# EAGLE design autoroute (EAGLE 9.6.2)
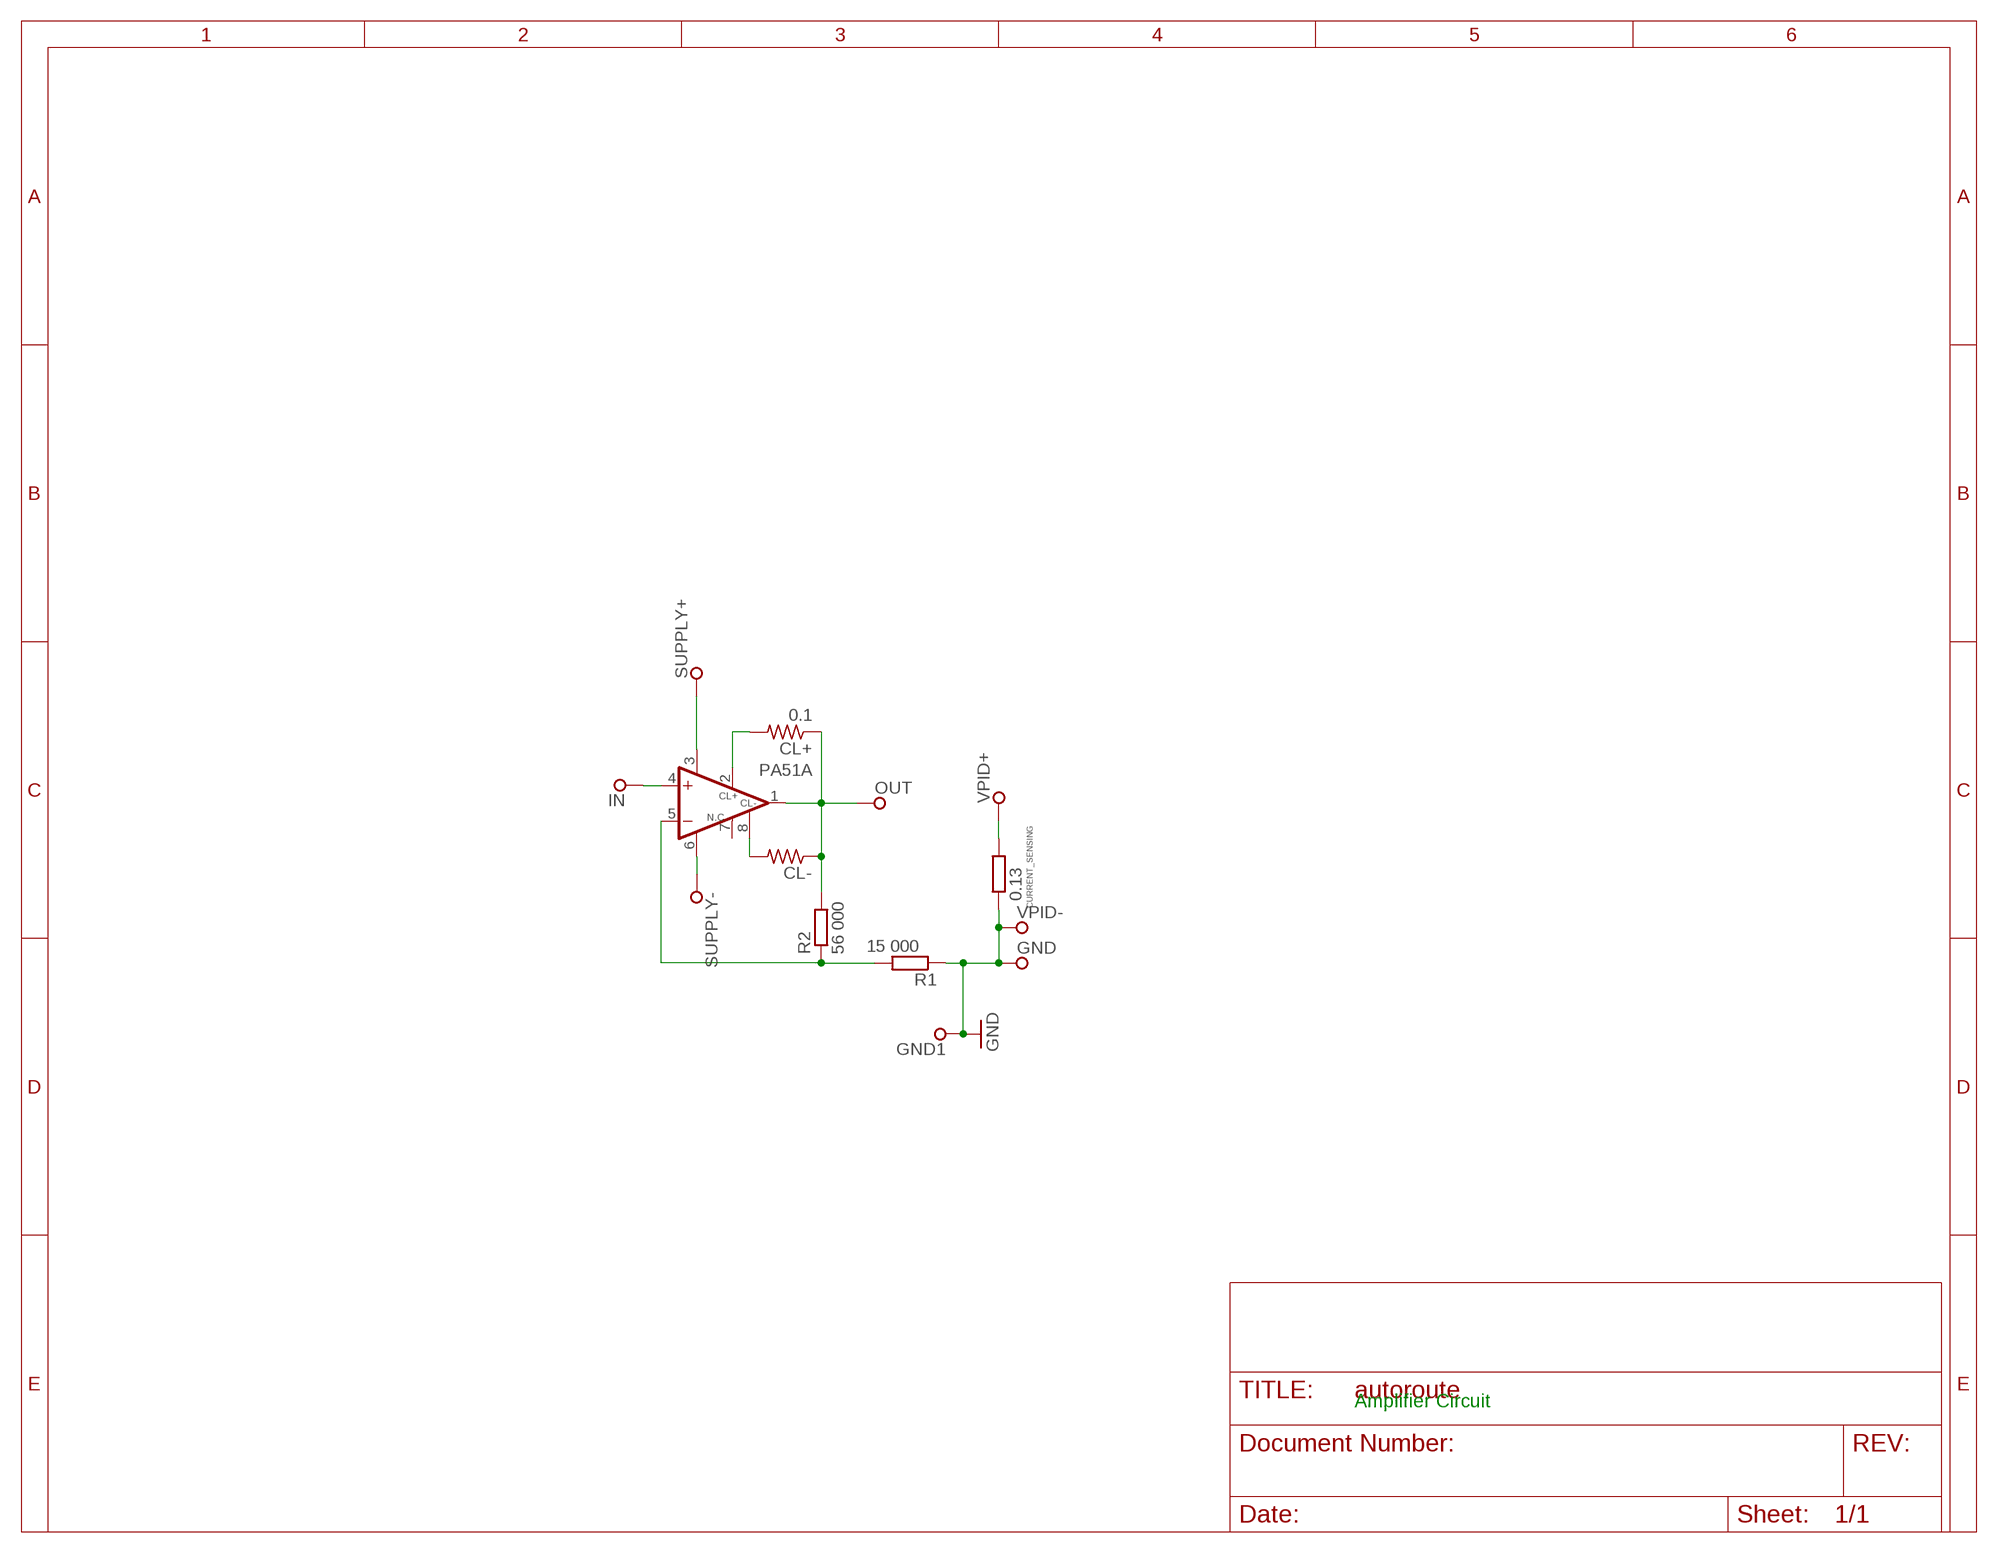
[diagram p0: schematic, sheet 1]

## Parts
CL+  0.1  R-US_VTA56  [VTA56]
CL-  R-US_VTA56  [VTA56]
CURRENT_SENSING  0.13  R-EU_V234/12  [V234/12]
GND  SPECIAL_DRILL_0.2500  [PAD_0.2500]
GND1  SPECIAL_DRILL_0.2500  [PAD_0.2500]
IN  SPECIAL_DRILL_0.2500  [PAD_0.2500]
OUT  SPECIAL_DRILL_0.2500  [PAD_0.2500]
R1  15 000  R-EU_V234/12  [V234/12]
R2  56 000  R-EU_V234/12  [V234/12]
SUPPLY+  SPECIAL_DRILL_0.2500  [PAD_0.2500]
SUPPLY-  SPECIAL_DRILL_0.2500  [PAD_0.2500]
U$1  PA51A  [0804MC]
VPID+  SPECIAL_DRILL_0.2500  [PAD_0.2500]
VPID-  SPECIAL_DRILL_0.2500  [PAD_0.2500]

## Nets
GND: CURRENT_SENSING.1 GND1.1 GND.1 R1.1 VPID-.1
N$1: CL+.1 CL-.1 OUT.1 R2.2 U$1.1(OUT)
N$2: R1.2 R2.1 U$1.5(-IN)
N$3: CL-.2 U$1.8(CL-)
N$4: SUPPLY-.1 U$1.6(V-)
N$5: SUPPLY+.1 U$1.3(V+)
N$6: CL+.2 U$1.2(CL+)
N$7: CURRENT_SENSING.2 VPID+.1
N$8: IN.1 U$1.4(+IN)
Unconnected: U$1.7(NC)

## Notes on the sheet
- Amplifier Circuit

## Library data of the parts
CL+ CL- = rcl:R-US_: RESISTOR, American symbol; SPICEPREFIX: R
CURRENT_SENSING R1 R2 = rcl:R-EU_: RESISTOR, European symbol; SPICEPREFIX: R
GND GND1 IN OUT SUPPLY+ SUPPLY- VPID+ VPID- = special-drill:SPECIAL_DRILL_: Special drills
U$1 = amp:PA51A

## Board
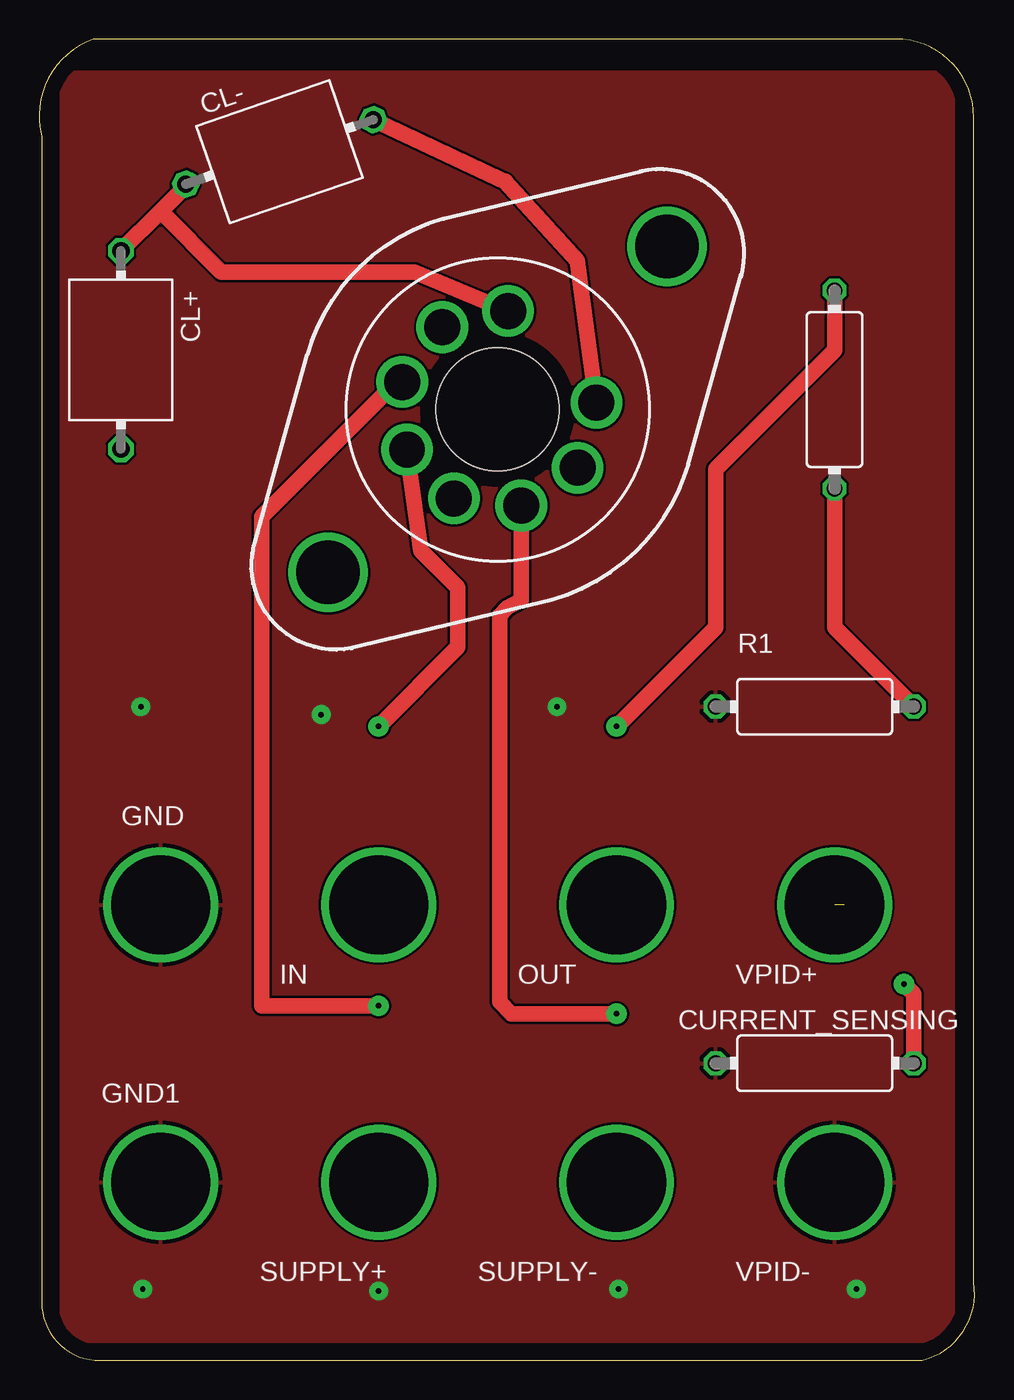
[diagram p1: board, top side]
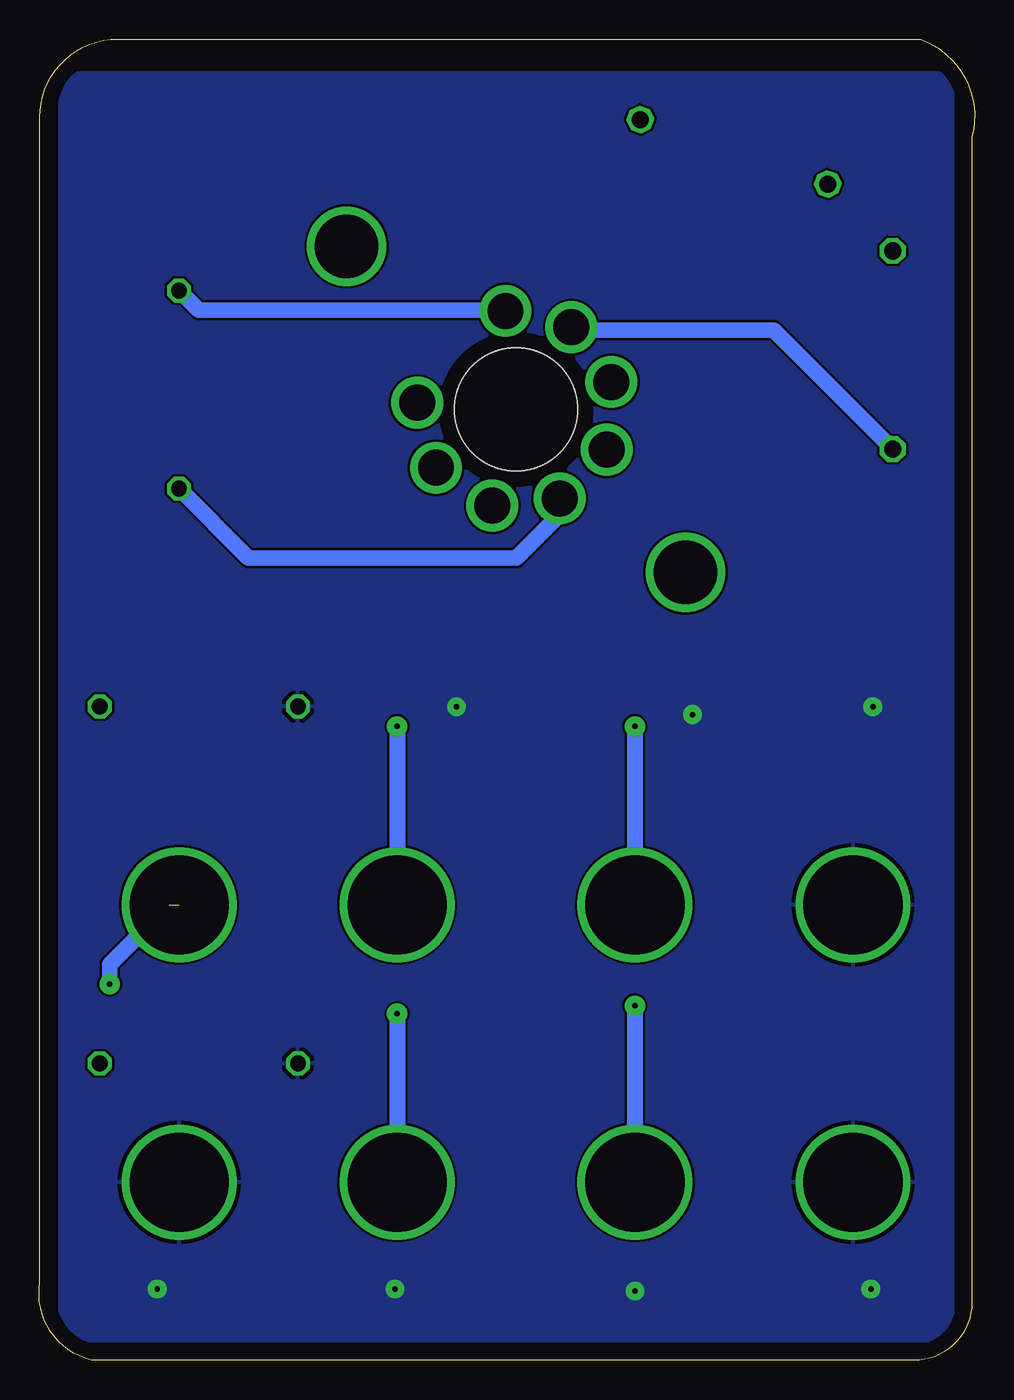
[diagram p2: board, bottom side, seen from below]

Size 59.94 x 84.7 mm. Coordinates in mm from the lower left corner, seen from the top.
Outline: 0.17,78.43 0.17,3.73 arc90 3.9,0 56.16,0 56.6,0.02 arc85 59.89,5 59.89,79.7 59.87,80.14 arc85 54.89,84.7 3.9,84.7 3.46,84.68 arc85 0.17,78.43
Copper layers (1*16): Top 0.035mm / dielectric 1.5mm / Bottom 0.035mm
Design rules "default *": minimum track width 6mil, minimum drill 0.35mm, track to track 6mil, track to pad 6mil, pad to pad 6mil, via to via 6mil, smd to smd 6mil, copper to edge 40mil, drill to drill 6mil, minimum pad ring 10mil, minimum via ring 8mil, stop-mask expansion 4mil, vias tented up to drill 0mil, thermal gap 10mil
Holes 7.87 mm at 29.38,60.96

### Footprints (pad centres in the part's own frame; a part is rotated, then mirrored left to right if it is on the bottom)
VTA56 = drill 1.1 octagon: 1 -6.35,0; 2 6.35,0
V234/12 = drill 1.016 octagon: 1 -6.35,0; 2 6.35,0
PAD_0.2500 = drill 6.35 pad 6.35: 1 0,0
0804MC = drill 2.3 pad 2.54: 1 -4.86,-4.08; 2 -1.1,-6.25; 3 3.18,-5.5; 4 5.97,-2.17; 5 5.97,2.17; 6 3.18,5.5; 7 -1.1,6.25; 8 -4.86,4.08 | drill 4.064 pad 4.5: G@1 -15.07,0; G@2 15.07,0 | hole 7.874: 0,0

### Placement (x,y rotation side)
CL+  5.25,64.77 270 top
CL-  15.41,77.47 19 top
CURRENT_SENSING  49.7,19.05 0 top
GND  7.79,29.21 0 top
GND1  7.79,11.43 0 top
IN  21.76,29.21 0 top
OUT  37,29.21 0 top
R1  49.7,41.91 0 top
R2  50.97,62.23 90 top
SUPPLY+  21.76,11.43 0 top
SUPPLY-  37,11.43 0 top
U$1  29.38,60.96 223.9 top
VPID+  50.97,29.21 0 top
VPID-  50.97,11.43 0 top

### Tracks (layer width: path | path; a pad name or v marks a point on that pad's centre or on a via)
GND  (via drill 0.35 pad 1.2)
  other vias: 6.65,4.57 21.76,4.45 33.19,41.91 6.52,41.91 52.37,4.57 37.13,4.57 18.08,41.4
  pour Bottom: 2.71,1.27 57.32,1.27 58.59,2.54 58.59,82.55 1.44,82.55 1.44,2.54
  pour Top: 2.71,1.27 57.32,1.27 58.59,2.54 58.59,82.55 1.44,82.55 1.44,2.54
N$1  (via drill 0.35 pad 1.3)
  Top 0.152: 9.06,74.93 CL-.1
  Top 1: 9.06,74.93 7.79,73.66 | 7.79,73.66 CL+.1 | 7.79,73.66 11.68,69.77 24.08,69.77 U$1.1 | R2.2 50.97,64.77 43.35,57.15 43.35,46.99 v37,40.64
  Bottom 1: R2.2 49.7,67.31 30.18,67.31 U$1.1
  Bottom 1.016: v37,40.64 OUT.1
N$2
  Top 1: R1.2 50.97,46.99 R2.1
  Bottom 1: U$1.5 26.58,54.23 29.38,51.44 46.53,51.44 R2.1
N$3
  Top 1: U$1.8 34.48,70.48
  Top 1.016: 34.48,70.48 29.88,75.56 CL-.2
N$4  (via drill 0.35 pad 1.3)
  Top 1: U$1.6 30.9,48.74 30,48.24 29.51,47.75 29.51,22.99 30.27,22.23 v37,22.23
  Bottom 1.016: v37,22.23 SUPPLY-.1
N$5  (via drill 0.35 pad 1.3)
  Top 1: U$1.3 22.88,62.72 14.27,54.1 14.27,22.73 v21.76,22.73
  Bottom 1.016: v21.76,22.73 SUPPLY+.1
N$6
  Bottom 0.152: 25.64,66.04 U$1.2
  Bottom 1: CL+.2 12.87,66.04 25.64,66.04
N$7  (via drill 0.35 pad 1.3)  (1 unrouted)
  Top 1: v55.42,24.13 56.05,23.5 CURRENT_SENSING.2
  Bottom 1: v55.42,24.13 55.42,25.4 51.61,29.21
N$8  (via drill 0.35 pad 1.3)
  Top 1: U$1.4 24.45,51.92 26.84,49.53 26.84,45.72 v21.76,40.64
  Bottom 1.016: v21.76,40.64 IN.1